# EAGLE design fcci-adapter (EAGLE 5.09)
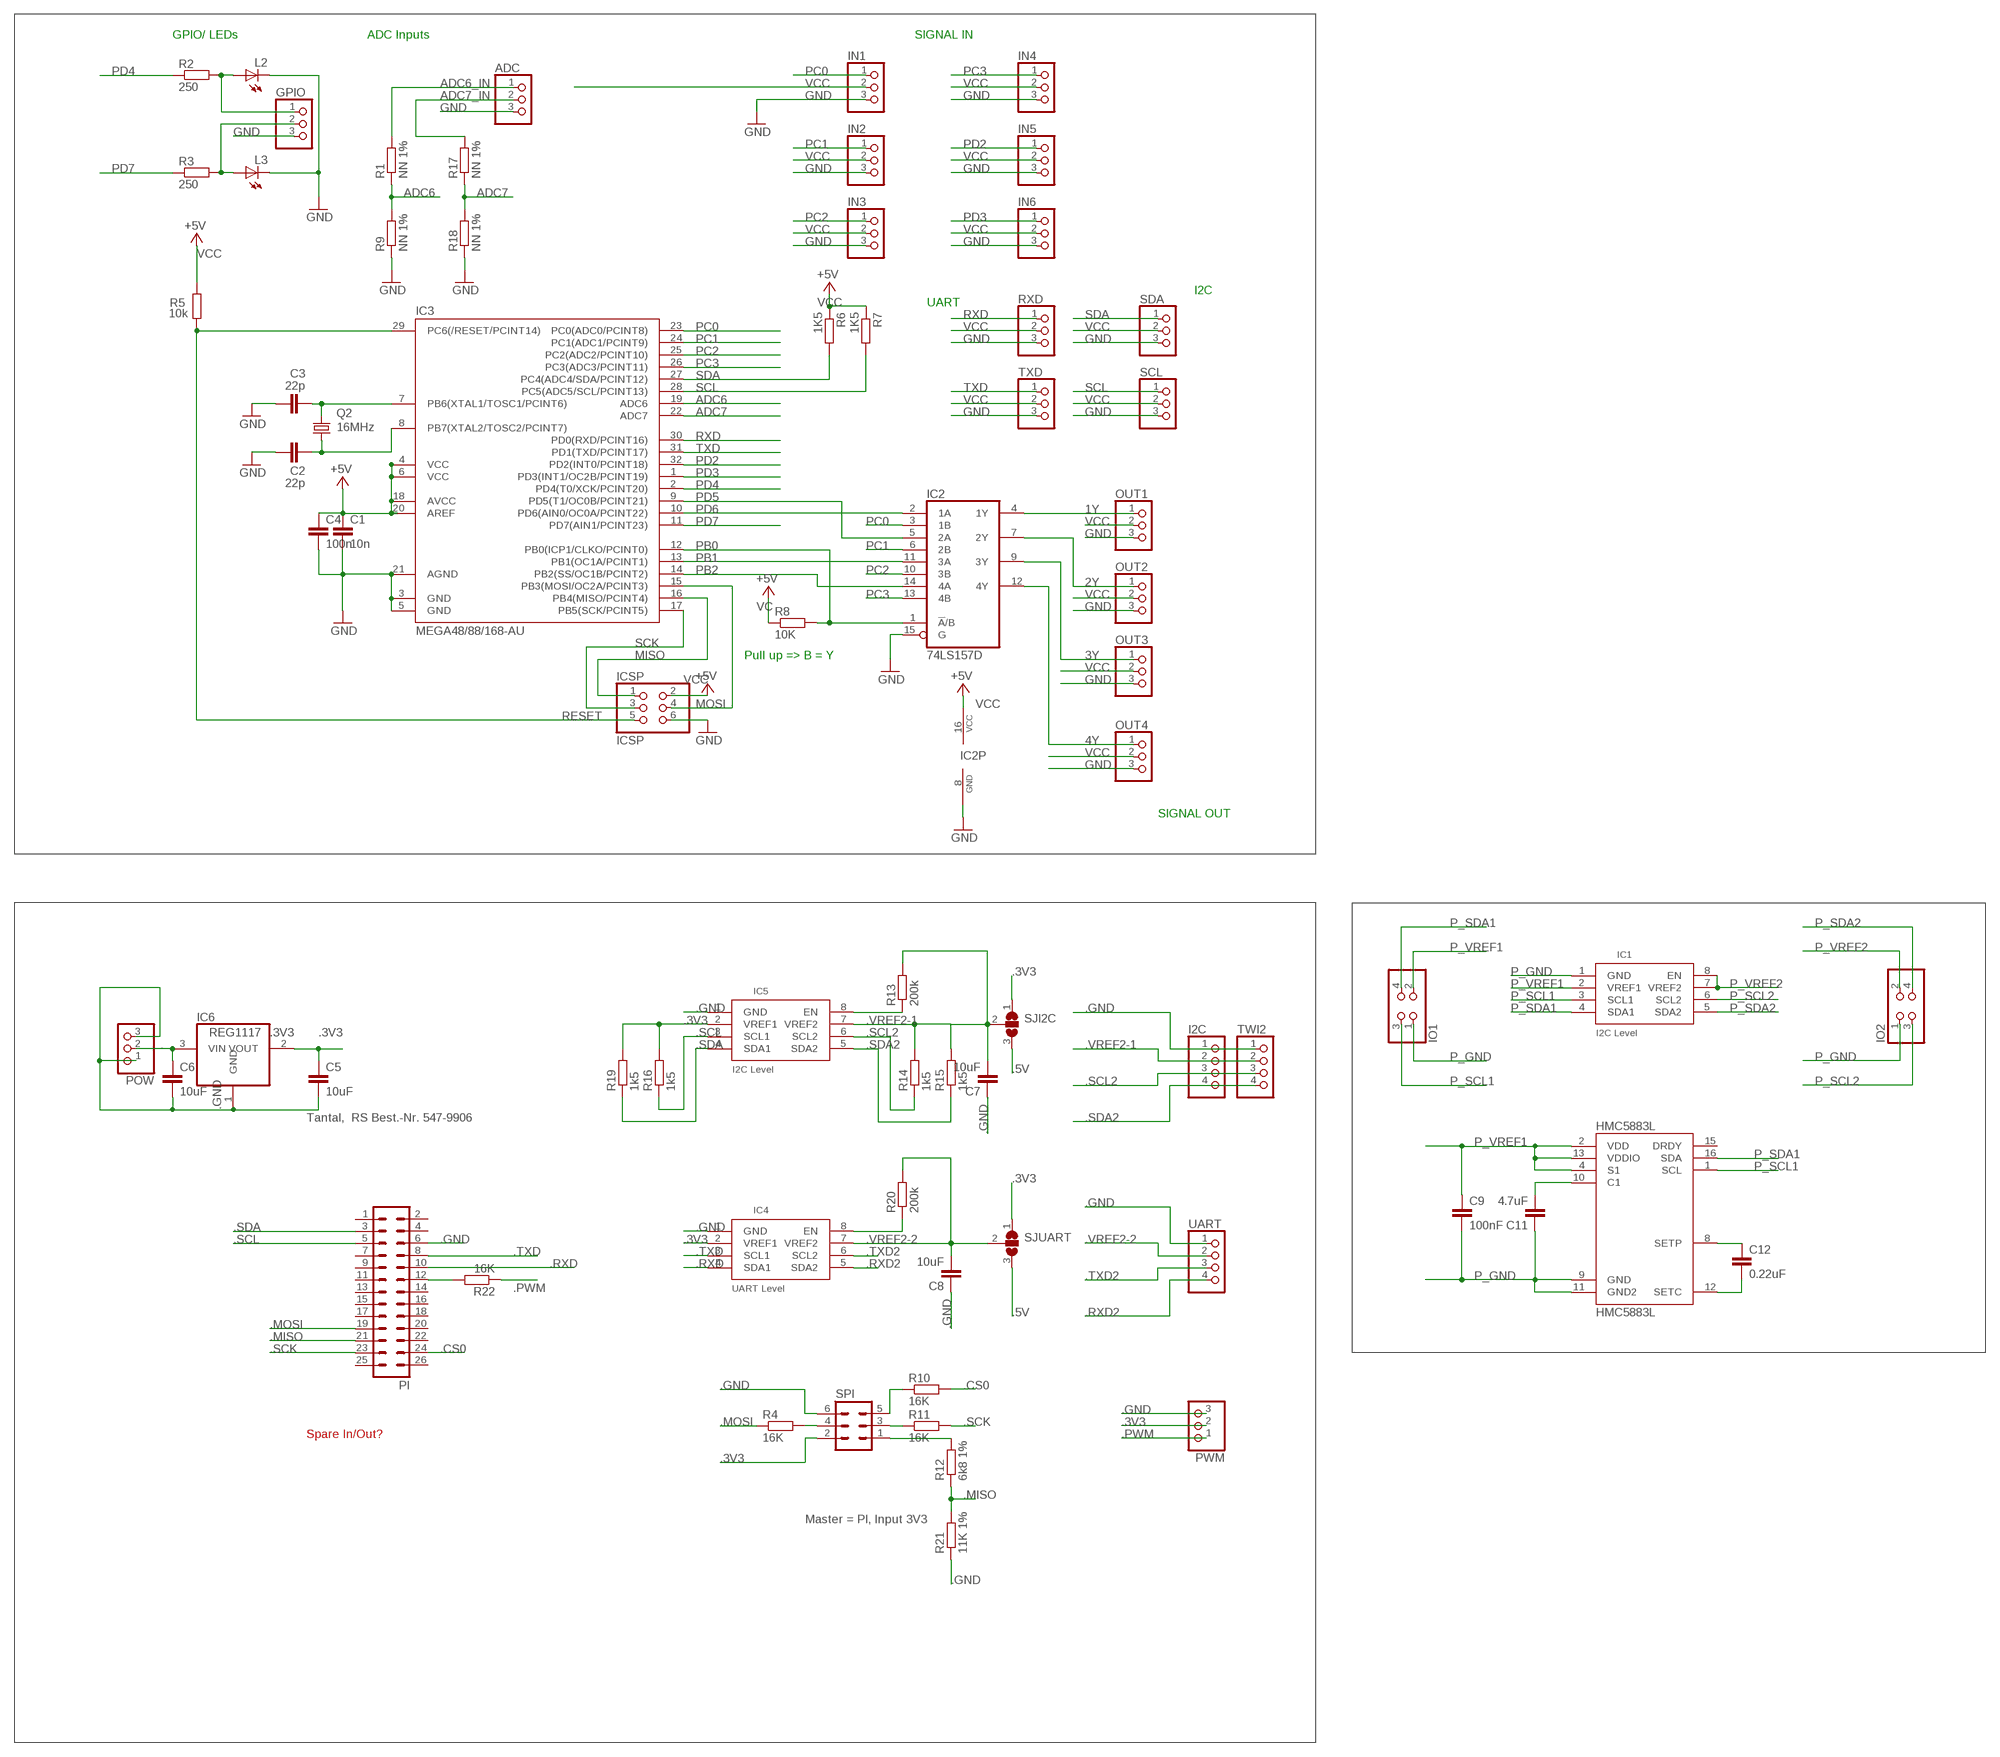
[diagram p0: schematic, sheet 1]

## Parts
ADC  PINHD-1X03_2.54-S  [1X03-S]
C1  10n  C-EUC1206K  [C1206K]
C2  22p  C-EUC1206K  [C1206K]
C3  22p  C-EUC1206K  [C1206K]
C4  100n  C-EUC1206K  [C1206K]
C5  10uF  C-EUC1608  [C1608]
C6  10uF  C-EUC1608  [C1608]
C7  10uF  C-EUC1608  [C1608]
C8  10uF  C-EUC1608  [C1608]
C9  100nF  C-EUC1206  [C1206]
C11  4.7uF  C-EUC1206  [C1206]
C12  0.22uF  C-EUC0805K  [C0805K]
GPIO  PINHD-1X03_2.54-S  [1X03-S]
HMC5883L  HMC5883L  [LPCC16]
I2C  PINHD-1X04_2.54-S  [1X04-S]
IC1  I2C Level  PCA9306  [SOIC8]
IC2  74LS157D  [SO16]
IC3  MEGA48/88/168-AU  [TQFP32-08]
IC4  UART Level  PCA9306  [SOIC8]
IC5  I2C Level  PCA9306  [SOIC8]
IC6  REG1117  [SOT223]
ICSP  ICSP  PINHD-2X3  [2X03]
IN1  PINHD-1X03_2.54-S  [1X03-S]
IN2  PINHD-1X03_2.54-S  [1X03-S]
IN3  PINHD-1X03_2.54-S  [1X03-S]
IN4  PINHD-1X03_2.54-S  [1X03-S]
IN5  PINHD-1X03_2.54-S  [1X03-S]
IN6  PINHD-1X03_2.54-S  [1X03-S]
IO1  PINHD-2X02_2.54  [2X02]
IO2  PINHD-2X02_2.54  [2X02]
L2  LEDCHIPLED_1206  [CHIPLED_1206]
L3  LEDCHIPLED_1206  [CHIPLED_1206]
OUT1  PINHD-1X03_2.54-S  [1X03-S]
OUT2  PINHD-1X03_2.54-S  [1X03-S]
OUT3  PINHD-1X03_2.54-S  [1X03-S]
OUT4  PINHD-1X03_2.54-S  [1X03-S]
PI  MA13-2  [MA13-2]
POW  PINHD-1X03_2.54-S  [1X03-S]
PWM  PINHD-1X03_2.54-S  [1X03-S]
Q2  16MHz  CRYTALHC49S  [HC49/S]
R1  NN 1%  R-EU_R0805  [R0805]
R2  250  R-EU_R1206  [R1206]
R3  250  R-EU_R1206  [R1206]
R4  16K  R-EU_R0805  [R0805]
R5  10k  R-EU_R1206  [R1206]
R6  1K5  R-EU_R1206  [R1206]
R7  1K5  R-EU_R1206  [R1206]
R8  10K  R-EU_R1206  [R1206]
R9  NN 1%  R-EU_R0805  [R0805]
R10  16K  R-EU_R0805  [R0805]
R11  16K  R-EU_R0805  [R0805]
R12  6k8 1%  R-EU_R0805  [R0805]
R13  200k  R-EU_R0805  [R0805]
R14  1k5  R-EU_R0805  [R0805]
R15  1k5  R-EU_R0805  [R0805]
R16  1k5  R-EU_R1206  [R1206]
R17  NN 1%  R-EU_R0805  [R0805]
R18  NN 1%  R-EU_R0805  [R0805]
R19  1k5  R-EU_R1206  [R1206]
R20  200k  R-EU_R0805  [R0805]
R21  11K 1%  R-EU_R0805  [R0805]
R22  16K  R-EU_R0805  [R0805]
RXD  PINHD-1X03_2.54-S  [1X03-S]
SCL  PINHD-1X03_2.54-S  [1X03-S]
SDA  PINHD-1X03_2.54-S  [1X03-S]
SJI2C  SJ2W  [SJ_2]
SJUART  SJ2W  [SJ_2]
SPI  MA03-2  [MA03-2]
TWI2  PINHD-1X04_2.54-S  [1X04-S]
TXD  PINHD-1X03_2.54-S  [1X03-S]
UART  PINHD-1X04_2.54-S  [1X04-S]

## Nets
1Y: IC2.4(1Y) OUT1.1
2Y: IC2.7(2Y) OUT2.1
3Y: IC2.9(3Y) OUT3.1
4Y: IC2.12(4Y) OUT4.1
.3V3: C5.1 IC4.2(VREF1) IC5.2(VREF1) IC6.2(VOUT) PWM.2 R16.2 R19.2 SJI2C.1 SJUART.1 SPI.2
.5V: C6.1 IC6.3(VIN) POW.2 SJI2C.3 SJUART.3
.CS0: PI.24 R10.2
.GND [gnd]: C5.2 C6.2 C7.1 C8.1 I2C.1 IC4.1(GND) IC5.1(GND) IC6.1(GND) PI.6 POW.1 POW.3 PWM.3 R21.1 SPI.6 TWI2.1 UART.1
.MISO: PI.21 R12.1 R21.2
.MOSI: PI.19 R4.1
.PWM: PWM.1 R22.1
.RXD: IC4.4(SDA1) PI.10
.RXD2: IC4.5(SDA2) UART.4
.SCK: PI.23 R11.2
.SCL: IC5.3(SCL1) PI.5 R16.1
.SCL2: I2C.3 IC5.6(SCL2) R14.1 TWI2.3
.SDA: IC5.4(SDA1) PI.3 R19.1
.SDA2: I2C.4 IC5.5(SDA2) R15.1 TWI2.4
.TXD: IC4.3(SCL1) PI.8
.TXD2: IC4.6(SCL2) UART.3
.VREF2-1: C7.2 I2C.2 IC5.7(VREF2) R13.2 R14.2 R15.2 SJI2C.2 TWI2.2
.VREF2-2: C8.2 IC4.7(VREF2) R20.2 SJUART.2 UART.2
ADC6: IC3.19(ADC6) R1.1 R9.2
ADC6_IN: ADC.1 R1.2
ADC7: IC3.22(ADC7) R17.1 R18.2
ADC7_IN: ADC.2 R17.2
GND [gnd]: ADC.3 C1.2 C2.1 C3.1 C4.2 GPIO.3 IC2.8(GND) IC2.15(G) IC3.3(GND) IC3.5(GND) IC3.21(AGND) ICSP.6 IN1.3 IN2.3 IN3.3 IN4.3 IN5.3 IN6.3 L2.C L3.C OUT1.3 OUT2.3 OUT3.3 OUT4.3 R9.1 R18.1 RXD.3 SCL.3 SDA.3 TXD.3
MISO: IC3.16(PB4(MISO/PCINT4)) ICSP.1
MOSI: IC3.15(PB3(MOSI/OC2A/PCINT3)) ICSP.4
N$1: GPIO.1 L2.A R2.2
N$2: GPIO.2 L3.A R3.2
N$3: IC5.8(EN) R13.1
N$4: R4.2 SPI.4
N$6: C2.2 IC3.8(PB7(XTAL2/TOSC2/PCINT7)) Q2.1
N$7: C3.2 IC3.7(PB6(XTAL1/TOSC1/PCINT6)) Q2.2
N$8: R10.1 SPI.5
N$9: R11.1 SPI.3
N$10: R12.2 SPI.1
N$12: IC4.8(EN) R20.1
N$18: C12.2 HMC5883L.12(SETC)
N$19: C12.1 HMC5883L.8(SETP)
N$20: C11.2 HMC5883L.10(C1)
P_GND: C9.2 C11.1 HMC5883L.9(GND) HMC5883L.11(GND2) IC1.1(GND) IO1.1 IO2.1
P_SCL1: HMC5883L.1(SCL) IC1.3(SCL1) IO1.3
P_SCL2: IC1.6(SCL2) IO2.3
P_SDA1: HMC5883L.16(SDA) IC1.4(SDA1) IO1.4
P_SDA2: IC1.5(SDA2) IO2.4
P_VREF1: C9.1 HMC5883L.2(VDD) HMC5883L.4(S1) HMC5883L.13(VDDIO) IC1.2(VREF1) IO1.2
P_VREF2: IC1.7(VREF2) IC1.8(EN) IO2.2
PB0: IC2.1(!A!/B) IC3.12(PB0(ICP1/CLKO/PCINT0)) R8.2
PB1: IC2.11(3A) IC3.13(PB1(OC1A/PCINT1))
PB2: IC2.14(4A) IC3.14(PB2(SS/OC1B/PCINT2))
PC0: IC2.3(1B) IC3.23(PC0(ADC0/PCINT8)) IN1.1
PC1: IC2.6(2B) IC3.24(PC1(ADC1/PCINT9)) IN2.1
PC2: IC2.10(3B) IC3.25(PC2(ADC2/PCINT10)) IN3.1
PC3: IC2.13(4B) IC3.26(PC3(ADC3/PCINT11)) IN4.1
PD2: IC3.32(PD2(INT0/PCINT18)) IN5.1
PD3: IC3.1(PD3(INT1/OC2B/PCINT19)) IN6.1
PD4: IC3.2(PD4(T0/XCK/PCINT20)) R2.1
PD5: IC2.5(2A) IC3.9(PD5(T1/OC0B/PCINT21))
PD6: IC2.2(1A) IC3.10(PD6(AIN0/OC0A/PCINT22))
PD7: IC3.11(PD7(AIN1/PCINT23)) R3.1
PWM_: PI.12 R22.2
RESET: IC3.29(PC6(/RESET/PCINT14)) ICSP.5 R5.1
RXD: IC3.30(PD0(RXD/PCINT16)) RXD.1
SCK: IC3.17(PB5(SCK/PCINT5)) ICSP.3
SCL: IC3.28(PC5(ADC5/SCL/PCINT13)) R7.2 SCL.1
SDA: IC3.27(PC4(ADC4/SDA/PCINT12)) R6.2 SDA.1
TXD: IC3.31(PD1(TXD/PCINT17)) TXD.1
VC: R8.1 ; supply symbol labelled +5V
VCC: C1.1 C4.1 IC2.16(VCC) IC3.4(VCC) IC3.6(VCC) IC3.18(AVCC) IC3.20(AREF) ICSP.2 IN1.2 IN2.2 IN3.2 IN4.2 IN5.2 IN6.2 OUT1.2 OUT2.2 OUT3.2 OUT4.2 R5.2 R6.1 R7.1 RXD.2 SCL.2 SDA.2 TXD.2 ; supply symbol labelled +5V
Unconnected: HMC5883L.15(DRDY) PI.1 PI.2 PI.4 PI.7 PI.9 PI.11 PI.13 PI.14 PI.15 PI.16 PI.17 PI.18 PI.20 PI.22 PI.25 PI.26

## Notes on the sheet
- GPIO/ LEDs | ADC Inputs | SIGNAL IN
- I2C
- UART
- Pull up => B = Y
- SIGNAL OUT
- Tantal,  RS Best.-Nr. 547-9906
- Spare In/Out?
- Master = PI, Input 3V3

## Library data of the parts
ADC GPIO IN1-IN6 OUT1-OUT4 POW PWM RXD SCL SDA TXD = pinhead-2:PINHD-1X03: PIN HEADER
C1-C9 C11 C12 = rcl:C-EU: CAPACITOR, European symbol
HMC5883L = 3DRobotics_Master_Library:HMC5883L: Honeywell HMC5883L 3-axis digital compass IC Successor to the HMC5843.; DATASHEET: http://www.dsscircuits.com/images/datasheets/HMC5883L.pdf; LINK: http://parts.digikey.com/1/parts/2057013-ic-compass-3-axis-i2c-16lcc-smd-hmc5883l-tr.html; MFGPN: HMC5883L-TR
I2C TWI2 UART = pinhead-2:PINHD-1X04: PIN HEADER
IC1 IC4 IC5 = 3DRobotics_Master_Library:PCA9306: I2C Level translator. Digi-Key part: 568-4215-1-ND By Jordi Munoz; DATASHEET: http://www.nxp.com/documents/data_sheet/PCA9306.pdf; LINK: http://search.digikey.com/scripts/DkSearch/dksus.dll?Detail&name=568-4215-1-ND; MFGPN: PCA9306D,118; PN: 568-4215-1-ND
IC2 = 74xx-us:74*157: Quadruple 2-line to 1-line data SELECTOR/MULTIPLEXER
IC3 = avr-7:MEGA48/88/168
IC6 = burr-brown:REG1117: 800mA and 1A Low Dropout (LDO) Positive Regulator 1.8V, 2.5V, 2.85V, 3.3V, 5V, and Adj
ICSP = pinhead:PINHD-2X3: PIN HEADER
IO1 IO2 = pinhead-2:PINHD-2X02: PIN HEADER
L2 L3 = led:LED: LED OSRAM: - CHIPLED LG R971, LG N971, LY N971, LG Q971, LY Q971, LO R971, LY R971 LH N974, LH R974 LS Q976, LO Q976, LY Q976 LO Q996 - Hyper CHIPLED LW Q18S LB Q993, LB Q99A, LB R99A - SideLED LS A670, LO A670, LY A670, LG A670, LP A670 LB A673, LV A673, LT A673, LW A673 LH A674 LY A675 LS A676, LA A676, LO A676, LY A676, LW A676 LS A679, LY A679, LG A679 - Hyper Micro SIDELED® LS Y876, LA Y876, LO Y876, LY Y876 LT Y87S - SmartLED LW L88C, LW L88S LB L89C, LB L89S, LG L890 LS L89K, LO L89K, LY L89K LS L896, LA L896, LO L896, LY L896 - TOPLED LS T670, LO T670, LY T670, LG T670, LP T670 LSG T670, LSP T670, LSY T670, LOP T670, LYG T670 LG T671, LOG T671, LSG T671 LB T673, LV T673, LT T673, LW T673 LH T674 LS T676, LA T676, LO T676, LY T676, LB T676, LH T676, LSB T676, LW T676 LB T67C, LV T67C, LT T67C, LS T67K, LO T67K, LY T67K, LW E67C LS E67B, LA E67B, LO E67B, LY E67B, LB E67C, LV E67C, LT E67C LW T67C LS T679, LY T679, LG T679 LS T770, LO T770, LY T770, LG T770, LP T770 LB T773, LV T773, LT T773, LW T773 LH T774 LS E675, LA E675, LY E675, LS T675 LS T776, LA T776, LO T776, LY T776, LB T776 LHGB T686 LT T68C, LB T68C - Hyper Mini TOPLED® LB M676 - Mini TOPLED Santana® LG M470 LS M47K, LO M47K, LY M47K Source: http://www.osram.convergy.de LUXEON: - LUMILED® LXK2-PW12-R00, LXK2-PW12-S00, LXK2-PW14-U00, LXK2-PW14-V00 LXK2-PM12-R00, LXK2-PM12-S00, LXK2-PM14-U00 LXK2-PE12-Q00, LXK2-PE12-R00, LXK2-PE12-S00, LXK2-PE14-T00, LXK2-PE14-U00 LXK2-PB12-K00, LXK2-PB12-L00, LXK2-PB12-M00, LXK2-PB14-N00, LXK2-PB14-P00, LXK2-PB14-Q00 LXK2-PR12-L00, LXK2-PR12-M00, LXK2-PR14-Q00, LXK2-PR14-R00 LXK2-PD12-Q00, LXK2-PD12-R00, LXK2-PD12-S00 LXK2-PH12-R00, LXK2-PH12-S00 LXK2-PL12-P00, LXK2-PL12-Q00, LXK2-PL12-R00 Source: www.luxeon.com KINGBRIGHT: KA-3528ASYC Source: www.kingbright.com
PI = con-lstb:MA13-2: PIN HEADER
Q2 = crystal:CRYTAL: CRYSTAL
R1-R22 = rcl:R-EU_: RESISTOR, European symbol
SJI2C SJUART = jumper:SJ2W: SMD solder JUMPER
SPI = con-lstb:MA03-2: PIN HEADER

## Net classes
0 default: width 0.254 mm, drill 0.305 mm, clearance 0.152 mm
1 power: width 0.61 mm, drill 0.508 mm, clearance 0.152 mm
2 gnd: width 0.305 mm, drill 0.508 mm, clearance 0.152 mm
3 usbvcc: width 0.508 mm, drill 0.508 mm, clearance 0.152 mm
4 aref: width 0.406 mm

## Board
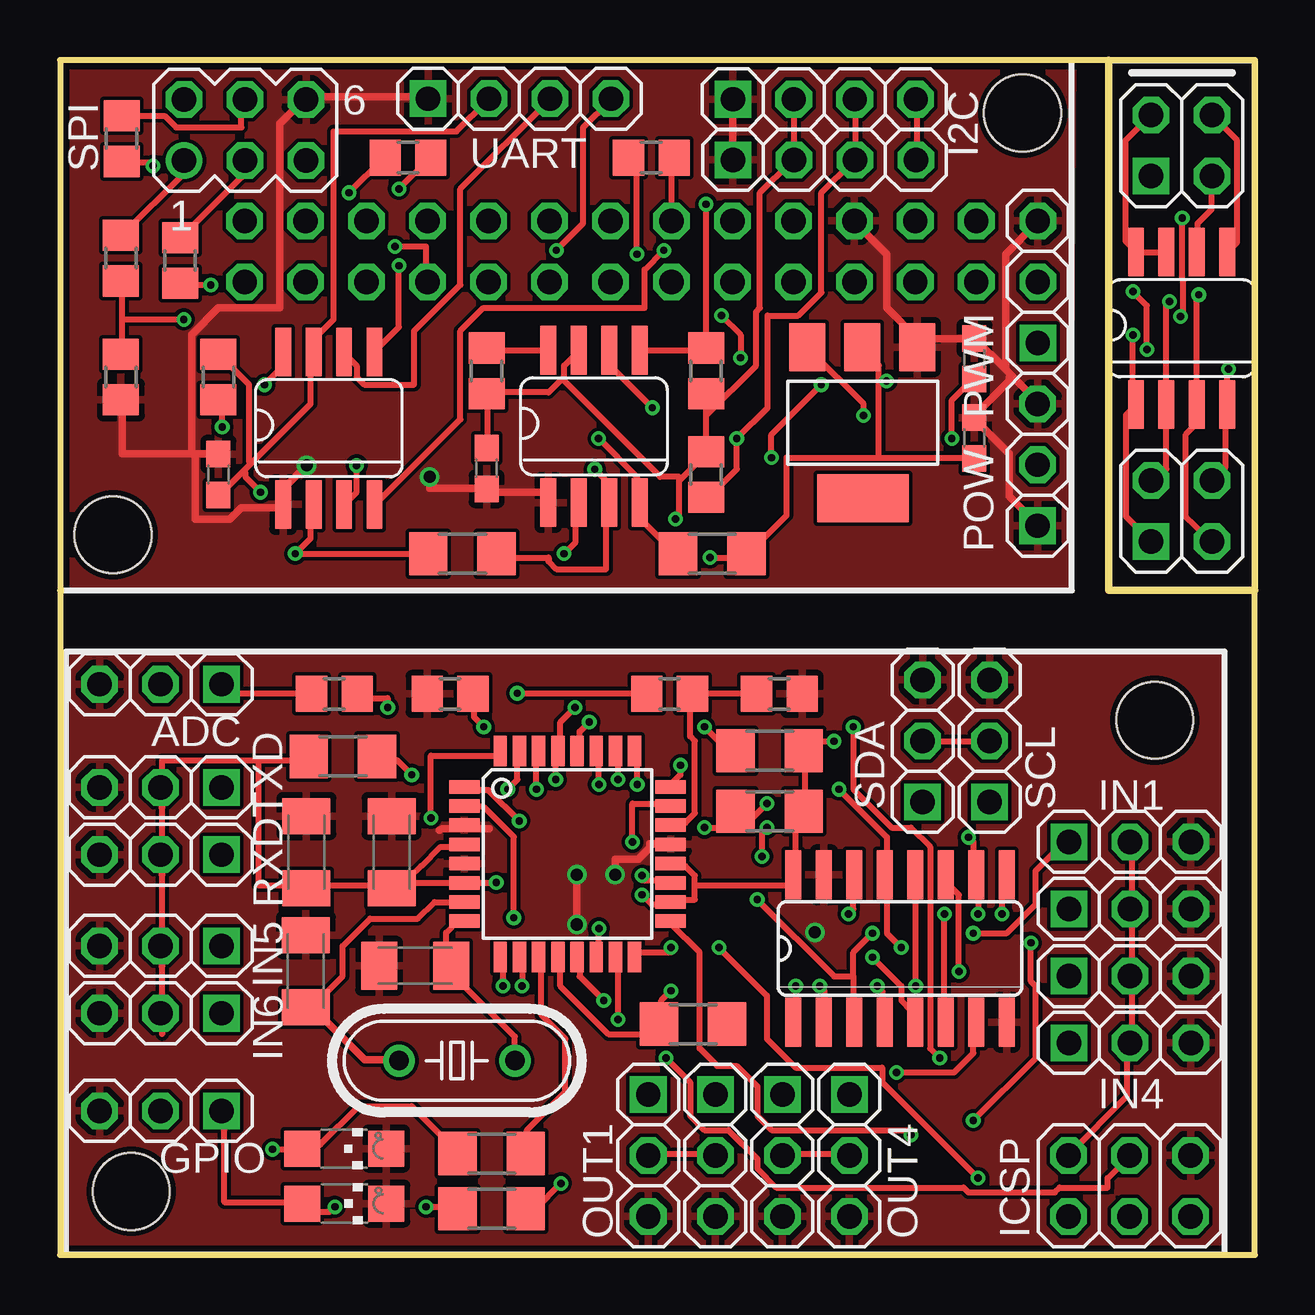
[diagram p1: board, top side]
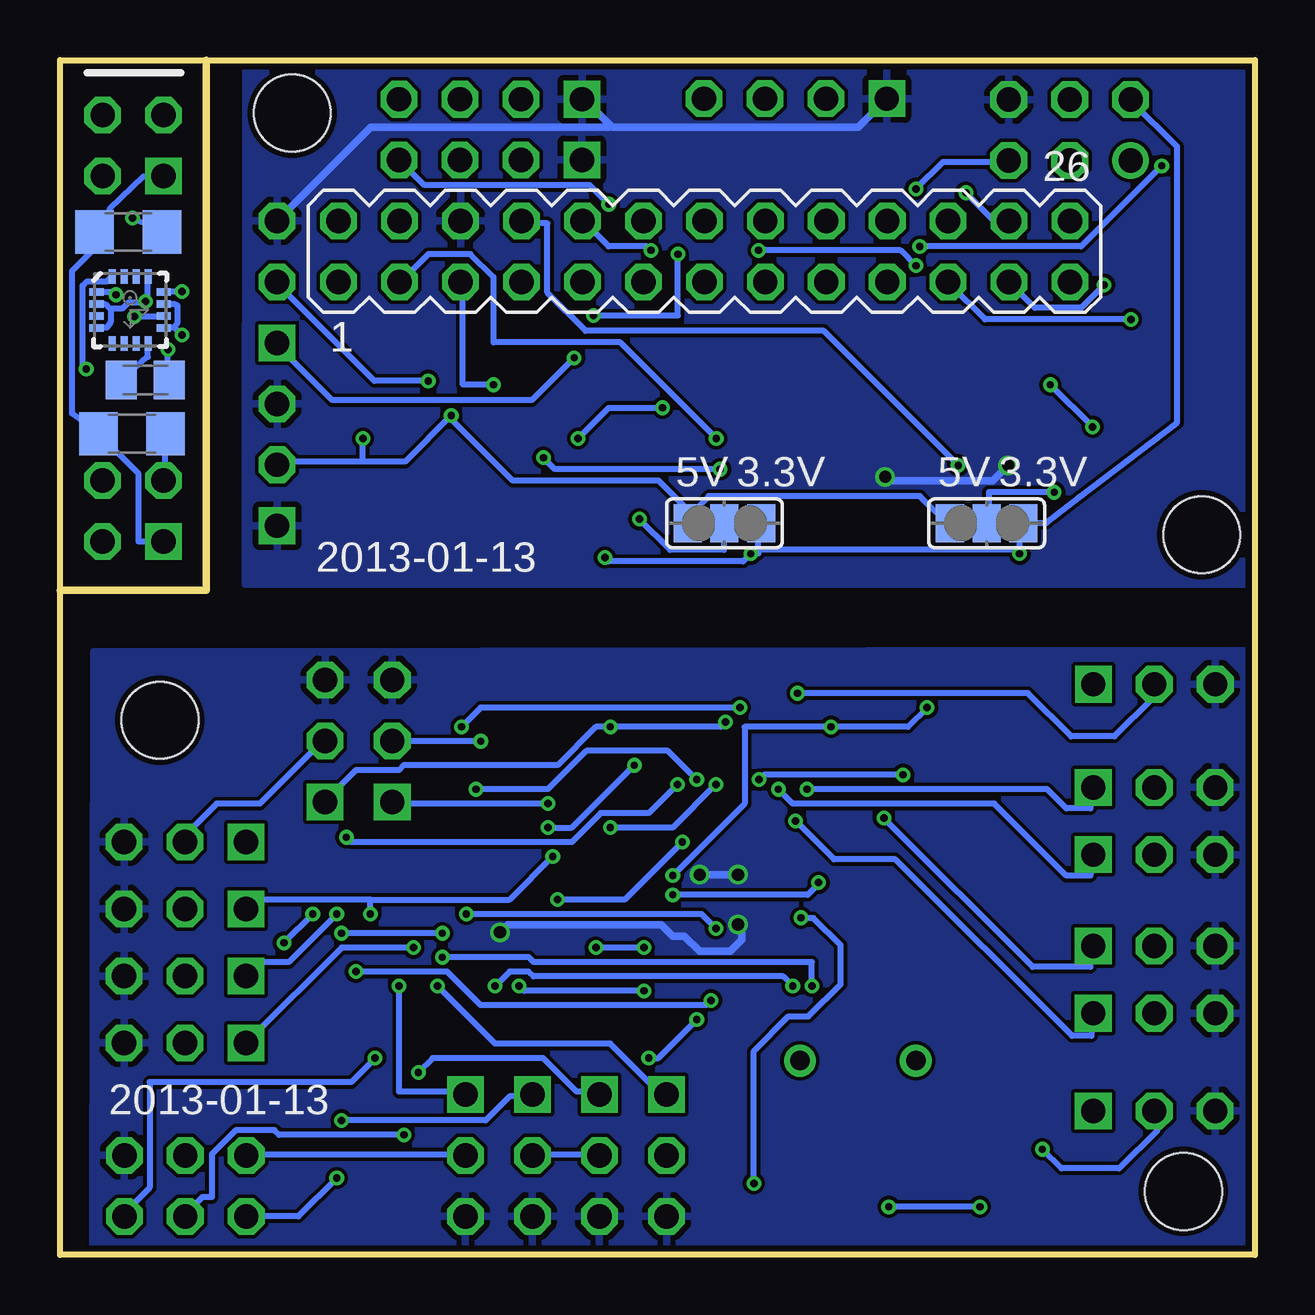
[diagram p2: board, bottom side, seen from below]

Size 49.78 x 49.78 mm. Coordinates in mm from the lower left corner, seen from the top.
Outline: 49.78,27.69 49.78,0 0,0 0,49.78 43.69,49.78
Outline: 49.78,27.69 49.78,49.78 43.69,49.78
Outline: 49.78,27.69 43.69,27.69 43.69,49.78
Copper layers (1*16): Top 0.035mm / dielectric 1.5mm / Bottom 0.035mm
Design rules "ITEADstudio_DRC": minimum track width 6mil, minimum drill 12mil, track to track 6mil, track to pad 6mil, pad to pad 6mil, via to via 6mil, smd to smd 0mil, copper to edge 10mil, drill to drill 10mil, minimum pad ring 10mil, minimum via ring 6mil, stop-mask expansion 2mil, vias tented up to drill 100mil, thermal gap 10mil
Holes 3.2 mm at 40.11,47.57 45.62,22.28 2.21,30 2.97,2.64

### Footprints (pad centres in the part's own frame; a part is rotated, then mirrored left to right if it is on the bottom)
1X03-S = drill 1.016 square: 1 -2.54,0 | drill 1.016 octagon: 2 0,0; 3 2.54,0
C1206K = smd 1.5 x 2: 1 -1.5,0; 2 1.5,0
C1608 = smd 1.1 x 1: 1 -0.85,0; 2 0.85,0
C1206 = smd 1.6 x 1.8: 1 -1.4,0; 2 1.4,0
C0805K = smd 1.3 x 1.6: 1 -1,0; 2 1,0
LPCC16 = smd 0.6 x 0.3: 1 -1.4,0.75; 2 -1.4,0.25; 3 -1.4,-0.25; 4 -1.4,-0.75; 9 1.4,-0.75; 10 1.4,-0.25; 11 1.4,0.25; 12 1.4,0.75 | smd 0.3 x 0.6: 5 -0.75,-1.4; 6 -0.25,-1.4; 7 0.25,-1.4; 8 0.75,-1.4; 13 0.75,1.4; 14 0.25,1.4; 15 -0.25,1.4; 16 -0.75,1.4
1X04-S = drill 1.016 square: 1 -3.81,0 | drill 1.016 octagon: 2 -1.27,0; 3 1.27,0; 4 3.81,0
SOIC8 = smd 0.66 x 2.032: 1 -1.905,-3.175; 2 -0.635,-3.175; 3 0.635,-3.175; 4 1.905,-3.175; 5 1.905,3.175; 6 0.635,3.175; 7 -0.635,3.175; 8 -1.905,3.175
SO16 = smd 0.66 x 2.032: 1 -4.445,-3.073; 2 -3.175,-3.073; 3 -1.905,-3.073; 4 -0.635,-3.073; 5 0.635,-3.073; 6 1.905,-3.073; 7 3.175,-3.073; 8 4.445,-3.073; 9 4.445,3.073; 10 3.175,3.073; 11 1.905,3.073; 12 0.635,3.073; 13 -0.635,3.073; 14 -1.905,3.073; 15 -3.175,3.073; 16 -4.445,3.073
TQFP32-08 = smd 1.27 x 0.559: 1 -4.293,2.8; 2 -4.293,2; 3 -4.293,1.2; 4 -4.293,0.4; 5 -4.293,-0.4; 6 -4.293,-1.2; 7 -4.293,-2; 8 -4.293,-2.8; 17 4.293,-2.8; 18 4.293,-2; 19 4.293,-1.2; 20 4.293,-0.4; 21 4.293,0.4; 22 4.293,1.2; 23 4.293,2; 24 4.293,2.8 | smd 0.559 x 1.27: 9 -2.8,-4.293; 10 -2,-4.293; 11 -1.2,-4.293; 12 -0.4,-4.293; 13 0.4,-4.293; 14 1.2,-4.293; 15 2,-4.293; 16 2.8,-4.293; 25 2.8,4.293; 26 2,4.293; 27 1.2,4.293; 28 0.4,4.293; 29 -0.4,4.293; 30 -1.2,4.293; 31 -2,4.293; 32 -2.8,4.293
SOT223 = smd 1.499 x 2.007: 1 -2.261,-3.15; 2 0.025,-3.15; 3 2.311,-3.15 | smd 3.81 x 2.007: 4 0,3.15
2X03 = drill 1.016 octagon: 1 -2.54,-1.27; 2 -2.54,1.27; 3 0,-1.27; 4 0,1.27; 5 2.54,-1.27; 6 2.54,1.27
2X02 = drill 1.016 square: 1 -1.27,-1.27 | drill 1.016 octagon: 2 -1.27,1.27; 3 1.27,-1.27; 4 1.27,1.27
CHIPLED_1206 = smd 1.5 x 1.5: A 0,-1.75; C 0,1.75
MA13-2 = drill 1.016 octagon: 1 -15.24,-1.27; 2 -15.24,1.27; 3 -12.7,-1.27; 4 -12.7,1.27; 5 -10.16,-1.27; 6 -10.16,1.27; 7 -7.62,-1.27; 8 -7.62,1.27; 9 -5.08,-1.27; 10 -5.08,1.27; 11 -2.54,-1.27; 12 -2.54,1.27; 13 0,-1.27; 14 0,1.27; 15 2.54,-1.27; 16 2.54,1.27; 17 5.08,-1.27; 18 5.08,1.27; 19 7.62,-1.27; 20 7.62,1.27; 21 10.16,-1.27; 22 10.16,1.27; 23 12.7,-1.27; 24 12.7,1.27; 25 15.24,-1.27; 26 15.24,1.27
HC49/S = drill 0.813 round: 1 -2.413,0; 2 2.413,0
R0805 = smd 1.3 x 1.5: 1 -0.95,0; 2 0.95,0
R1206 = smd 1.6 x 1.803: 1 -1.422,0; 2 1.422,0
SJ_2 = smd 1.168 x 1.6: 1 -1.524,0; 2 0,0; 3 1.524,0
MA03-2 = drill 1.016 round: 1 -2.54,-1.27 | drill 1.016 octagon: 2 -2.54,1.27; 3 0,-1.27; 4 0,1.27; 5 2.54,-1.27; 6 2.54,1.27

### Placement (x,y rotation side)
ADC  4.19,23.77 180 top
C1  13.82,16.78 90 top
C2  14.8,12.04 0 top
C3  10.25,11.82 270 top
C4  10.26,16.78 90 top
C5  38.1,34.04 90 top
C6  38.1,37.34 90 top
C7  17.78,32.77 90 top
C8  6.6,32.51 270 top
C9  46.79,34.21 180 bottom
C11  46.94,42.62 0 bottom
C12  46.23,36.45 0 bottom
GPIO  4.19,5.99 180 top
HMC5883L  46.86,39.37 0 bottom
I2C  31.84,48.15 0 top
IC1  46.74,38.61 0 top
IC2  35,12.76 0 top
IC3  21.15,16.7 0 top
IC4  11.2,34.44 0 top
IC5  22.25,34.52 0 top
IC6  33.45,34.67 180 top
ICSP  44.56,2.87 0 top
IN1  44.58,17.2 0 top
IN2  44.58,14.41 0 top
IN3  44.58,11.62 0 top
IN4  44.58,8.83 0 top
IN5  4.19,12.87 180 top
IN6  4.19,10.07 180 top
IO1  46.74,30.99 0 top
IO2  46.73,46.21 0 top
L2  11.85,2.13 270 top
L3  11.84,4.42 270 top
OUT1  24.51,4.14 270 top
OUT2  27.3,4.14 270 top
OUT3  30.1,4.14 270 top
OUT4  32.89,4.14 270 top
PI  22.94,41.81 0 bottom
POW  40.74,32.92 90 top
PWM  40.74,40.54 90 top
Q2  16.54,8.09 180 top
R1  11.43,23.37 180 top
R2  17.98,1.92 180 top
R3  17.98,4.22 180 top
R4  2.57,46.51 90 top
R5  11.79,20.76 180 top
R6  29.57,18.48 180 top
R7  29.57,21.01 180 top
R8  26.38,9.61 180 top
R9  16.26,23.37 0 top
R10  14.5,45.72 180 top
R11  5,41.43 270 top
R12  2.54,41.53 90 top
R13  17.78,36.83 270 top
R14  26.92,32.51 90 top
R15  26.92,36.83 270 top
R16  16.76,29.21 180 top
R17  25.4,23.37 180 top
R18  29.97,23.37 180 top
R19  27.18,29.21 0 top
R20  6.6,36.58 90 top
R21  2.54,36.58 90 top
R22  24.64,45.72 0 top
RXD  4.19,16.67 180 top
SCL  38.73,21.41 90 top
SDA  35.94,21.41 90 top
SJI2C  22.1,30.48 180 bottom
SJUART  11.18,30.48 180 bottom
SPI  7.71,46.87 0 top
TWI2  31.85,45.62 0 top
TXD  4.19,19.47 180 top
UART  19.14,48.17 0 top

### Tracks (layer width: path | path; a pad name or v marks a point on that pad's centre or on a via)
1Y  (via drill 0.3)
  Top 0.254: v34.05,11.2 34.25,11 34.25,9.8 IC2.4
  Bottom 0.254: v34.05,11.2 31.65,8.8 26.85,8.8 24.85,6.8 24.65,6.8 OUT1.1
2Y  (via drill 0.3)
  Top 0.254: v34.85,7.6 37.25,7.6 38.05,8.4 38.05,9.6 IC2.7
  Bottom 0.254: v34.85,7.6 34.25,8.2 29.65,8.2 28.25,6.8 27.45,6.8 OUT2.1
3Y  (via drill 0.3)
  Top 0.254: v39.25,14.2 39.25,15.8 IC2.9 | v40.45,13 40.45,11.4 40.65,11.2 40.65,8.2 v38.05,5.6
  Bottom 0.254: v40.45,13 v39.25,14.2 | v38.05,5.6 32.05,5.6 31.05,6.6 30.25,6.6 OUT3.1
4Y  (via drill 0.3)
  Top 0.254: v35.65,11.2 35.65,15.8 IC2.12
  Bottom 0.254: v35.65,11.2 35.65,6.8 33.05,6.8 OUT4.1
.3V3  (via drill 0.3)
  Top 0.254: v21,29.21 21.48,29.69 21.48,31.29 IC5.2 | IC4.2 10.44,31.13 10.44,29.85 v9.8,29.21 15.24,29.21 R16.2 | v27.08,29.05 28.52,29.05 R19.2 28.68,29.21 30.28,30.81 30.28,33.21 34.12,33.21 | 34.12,33.21 37.96,33.21 C5.1 | 34.12,36.41 34.12,37.05 33.48,37.69 IC6.2 | 34.12,33.21 34.12,36.41 | 34.12,36.41 v34.44,36.41
  Bottom 0.254: 20.68,29.37 20.68,29.21 v21,29.21 21.32,28.89 26.92,28.89 v27.08,29.05 | 20.68,29.37 20.68,30.33 SJI2C.1 | 9.8,29.37 9.8,30.33 SJUART.1 9.64,30.49 8.68,30.49 7.32,31.57 3.24,34.67 3.24,46.17 5.16,48.09 SPI.2 | 9.8,29.37 20.68,29.37 | v9.8,29.21 9.8,29.37 | v34.44,36.41 36.68,36.41 40.68,40.41 PWM.2
.5V  (via drill 0.3)
  Top 0.254: v33.48,34.97 33.48,35.45 31.24,37.69 IC6.3 | v37.16,34.01 37.16,35.61 37.96,36.41 C6.1
  Bottom 0.254: SJUART.3 12.84,30.49 13.96,31.61 22.76,31.61 23.56,30.81 23.56,30.49 SJI2C.3 23.56,30.97 24.84,32.25 30.92,32.25 33.48,34.81 v33.48,34.97 35.4,33.05 37.16,33.05 | 37.16,33.05 40.68,33.05 POW.2 | 37.16,33.05 v37.16,34.01
.CS0  (via drill 0.3)
  Top 0.254: v12.04,44.25 13.48,45.69 R10.2
  Bottom 0.254: v12.04,44.25 10.92,43.13 10.28,43.13 PI.24
.GND  (via drill 0.51)
  Top 0.305: IC5.1 20.2,31.45 20.2,31.77 17.8,31.77 C7.1 17.64,31.93 15.4,31.93 v15.4,32.41 | 5.48,33.37 2.6,33.37 2.6,35.61 R21.1 | 5.64,33.37 5.48,33.37 | 5.64,33.37 6.6,33.37 C8.1 | 5.64,33.37 5.64,30.65 7.08,30.65 7.56,31.13 9.16,31.13 IC4.1 9.32,31.29 9.32,31.93 v10.28,32.89 | 35.72,38.17 37.96,38.17 C6.2 38.12,38.17 39.32,36.97 | 35.72,38.17 35.72,37.85 IC6.1 35.72,38.17 | 39.32,36.97 39.64,36.65 | 39.64,36.65 40.68,35.61 POW.3 | 35.72,38.17 34.44,39.45 34.44,41.69 33.16,42.97 PI.6 | PWM.3 40.68,42.97 39.4,41.69 39.4,37.05 39.32,36.97 | I2C.1 28.04,48.09 28.04,45.69 TWI2.1 | UART.1 15.24,48.25 10.28,48.25 SPI.6 10.12,48.09 9.16,47.13 9.16,39.45 6.6,39.45 5.48,38.33 5.48,33.37 | 39.64,36.65 39.56,36.57 39.56,36.41 38.12,34.97 C5.2 38.12,34.81 39.56,33.37 39.56,31.61 40.68,30.49 POW.1
  Bottom 0.305: v15.4,32.41 15.24,32.25 10.92,32.25 v10.28,32.89 | 26.84,47.05 26.76,46.97 16.52,46.97 15.4,48.09 UART.1 | 26.84,47.05 27.88,48.09 I2C.1 | PWM.3 40.68,43.13 36.84,46.97 26.92,46.97 26.84,47.05
  pour Top: 0.13,49.81 0,27.94 42.06,27.79 42.19,50.06
  pour Bottom: -0.43,49.58 -0.25,27.94 42.06,27.94 42.04,49.76
.MISO  (via drill 0.3)
  Top 0.254: 2.6,38.97 2.6,40.57 R12.1 | 2.6,38.97 2.6,37.53 R21.2 | 2.6,38.97 v5.16,38.97
  Bottom 0.254: v5.16,38.97 11.24,38.97 12.68,40.41 PI.21
.MOSI  (via drill 0.3)
  Top 0.254: v3.88,45.37 3.88,45.53 2.6,45.53 R4.1 | v13.96,42.01 15.24,42.01 15.24,40.57 PI.19
  Bottom 0.254: v3.88,45.37 7.24,42.01 v13.96,42.01
.PWM  (via drill 0.3)
  Top 0.254: v24.04,41.69 24.04,45.37 23.72,45.69 R22.1 | v27.56,39.13 28.36,38.33 v28.36,37.37
  Bottom 0.254: v24.04,41.69 24.04,39.13 v27.56,39.13 | v28.36,37.37 30.12,35.61 38.44,35.61 40.68,37.85 PWM.1
.RXD  (via drill 0.3)
  Top 0.254: v25.16,41.85 24.36,41.05 24.36,39.45 17.64,39.45 16.68,38.49 16.68,34.81 13.16,31.29 IC4.4
  Bottom 0.254: v25.16,41.85 25.32,42.01 26.92,42.01 27.88,42.97 PI.10
.RXD2  (via drill 0.3)
  Top 0.254: v14.12,41.21 14.12,38.65 13.16,37.69 IC4.5 | v20.68,41.85 21.8,42.97 21.8,46.97 22.92,48.09 UART.4
  Bottom 0.254: v14.12,41.21 14.76,41.85 v20.68,41.85
.SCK  (via drill 0.3)
  Top 0.254: v6.28,40.41 5.16,40.41 R11.2
  Bottom 0.254: v6.28,40.41 7.24,39.45 9.16,39.45 10.12,40.41 PI.23
.SCL  (via drill 0.3)
  Top 0.254: R16.1 18.28,29.05 20.36,29.05 20.36,28.89 20.68,28.57 22.76,28.57 22.76,31.29 IC5.3 22.76,31.45 22.76,32.25 v22.28,32.73 | v31.72,36.25 29.64,34.17 v29.64,33.21
  Bottom 0.254: v31.72,36.25 33,36.25 33,40.41 PI.5 | v29.64,33.21 29.16,32.73 v22.28,32.73
.SCL2  (via drill 0.3)
  Top 0.254: I2C.3 33.16,48.09 33.16,45.69 TWI2.3 33,45.53 31.72,44.25 31.72,40.09 30.76,39.13 29.48,39.13 29.48,35.29 v28.2,34.01 28.2,32.73 27.08,31.61 R14.1 | v24.68,35.29 22.92,37.05 22.92,37.53 IC5.6
  Bottom 0.254: v28.2,34.01 26.92,35.29 v24.68,35.29
.SDA  (via drill 0.3)
  Top 0.254: R19.1 25.64,29.21 24.2,30.65 24.2,31.29 IC5.4 24.04,31.45 24.04,32.41 v22.44,34.01
  Bottom 0.254: v22.44,34.01 26.44,38.01 31.72,38.01 31.72,40.73 32.68,41.69 34.44,41.69 35.56,40.57 PI.3
.SDA2  (via drill 0.3)
  Top 0.254: IC5.5 24.2,37.69 26.92,37.69 R15.1 26.92,37.85 v26.92,43.77 | I2C.4 35.72,48.09 35.72,45.69 TWI2.4
  Bottom 0.254: v26.92,43.77 27.72,44.57 34.6,44.57 35.56,45.53 TWI2.4
.TXD  (via drill 0.3)
  Top 0.254: v12.36,32.89 12.36,31.77 11.88,31.29 IC4.3
  Bottom 0.254: v12.36,32.89 17.96,38.49 27.88,38.49 29.48,40.09 29.48,42.97 30.44,42.97 PI.8
.TXD2
  Top 0.254: IC4.6 11.88,37.53 12.36,37.05 12.36,36.57 12.68,36.25 14.76,36.25 14.76,38.49 16.68,40.41 16.68,44.41 20.36,48.09 UART.3
.VREF2-1  (via drill 0.3)
  Top 0.254: C7.2 17.8,33.69 17.8,35.77 R13.2 17.8,35.93 20.36,35.93 20.92,36.49 | 20.92,36.49 21,36.57 21,37.05 21.48,37.53 IC5.7 | I2C.2 30.6,48.09 30.6,45.69 TWI2.2 30.44,45.53 29.16,44.25 29.16,39.45 29,39.29 29,37.05 26.92,34.97 | 26.92,34.97 26.92,35.77 R15.2 | 26.92,34.97 26.92,33.53 R14.2 26.92,33.37 25.88,32.33 | v25.64,30.65 25.8,30.81 25.8,32.25 25.88,32.33 | 20.92,36.49 25,32.41 25.8,32.41 25.88,32.33
  Bottom 0.254: v25.64,30.65 24.36,29.37 22.12,29.37 22.12,30.33 SJI2C.2
.VREF2-2  (via drill 0.3)
  Top 0.254: 7.96,32.97 10.44,35.45 10.44,37.53 IC4.7 10.6,37.69 10.6,38.17 11.4,38.97 11.4,46.81 16.52,46.81 17.8,48.09 UART.2 | 7.64,32.65 7.96,32.97 | 7.64,32.65 6.76,31.77 C8.2 | R20.2 6.76,37.37 7.88,36.25 7.88,33.05 7.96,32.97 | v8.36,31.77 7.72,32.41 7.72,32.57 7.64,32.65
  Bottom 0.254: v8.36,31.77 11.08,31.77 11.08,30.49 SJUART.2
ADC6  (via drill 0.3)
  Top 0.254: v24.25,15.8 24.25,15.6 25.25,15.6 IC3.19 | v17.65,22 17.25,22.4 17.25,23.2 R9.2 | v13.65,22.8 13.65,23.2 12.45,23.2 R1.1
  Bottom 0.254: v24.25,15.8 21.25,18.8 21.25,22 v17.65,22 14.45,22 v13.65,22.8
ADC6_IN
  Top 0.254: R1.2 10.45,23.4 6.85,23.4 ADC.1
ADC7
  Top 0.254: IC3.22 25.45,18 26.05,18 26.45,18.4 26.45,21.4 26.25,21.6 26.25,23.2 R17.1 26.45,23.4 28.85,23.4 R18.2
ADC7_IN  (via drill 0.3)
  Top 0.254: v19.05,23.4 24.25,23.4 R17.2
  Bottom 0.254: v19.05,23.4 9.45,23.4 7.65,21.6 5.85,21.6 4.25,23.2 ADC.2
GND  (via drill 0.51)
  Top 0.305: v23.13,15.84 23.13,16.48 24.09,16.48 24.57,16.96 24.57,17.12 25.37,17.12 IC3.21 | v21.53,13.76 v21.53,15.84 | 17.89,17.76 16.89,17.76 IC3.3 16.73,17.76 15.93,17.76 15.81,17.7
  Bottom 0.305: v21.53,15.84 v23.13,15.84 | v21.53,13.76 21.37,13.6 21.37,13.12 21.85,12.64 23.13,12.64 23.77,13.28 24.25,13.28 24.73,13.76 31.13,13.76 v31.45,13.44
  pour Bottom: 0.08,25.2 0.25,0 48.41,0 48.39,25.12
  pour Top: 0.13,24.92 0.25,0 48.41,-0.15 48.29,24.92
MISO  (via drill 0.3)
  Top 0.254: v25.45,12.8 25.45,12.6 24.05,12.6 IC3.16 | v27.45,12.8 29.45,10.8 29.45,9 30.65,7.8 34.25,7.8 34.25,7.2 v38.25,3.2
  Bottom 0.254: v25.45,12.8 v27.45,12.8 | v38.25,3.2 39.85,1.6 41.85,1.6 ICSP.1
MOSI  (via drill 0.3)
  Top 0.254: v23.25,9.8 23.25,12.4 IC3.15 | v25.25,8.2 26.25,7.2 26.25,5.8 26.85,5.2 27.85,5.2 29.05,4 29.05,3.6 29.85,2.8 37.65,2.8 37.85,2.6 41.45,2.6 41.65,2.8 43.65,2.8 43.65,3.2 44.45,4 ICSP.4
  Bottom 0.254: v23.25,9.8 24.85,8.2 v25.25,8.2
N$1  (via drill 0.3)
  Top 0.254: GPIO.1 6.85,5.2 6.85,2.2 10.05,2.2 L2.A 10.25,2 10.25,1.8 11.25,1.8 v11.45,2 | v15.25,2 16.45,2 R2.2
  Bottom 0.254: v11.45,2 v15.25,2
N$2  (via drill 0.3)
  Top 0.254: v8.85,4.4 10.05,4.4 L3.A 10.25,4.6 10.85,4.6 12.45,6.2 14.65,6.2 16.45,4.4 R3.2
  Bottom 0.254: v8.85,4.4 8.05,3.6 5.65,3.6 4.05,5.2 GPIO.2
N$3
  Top 0.254: R13.1 17.8,37.69 20.2,37.69 IC5.8
N$4
  Top 0.254: R4.2 2.6,47.45 4.36,47.45 4.84,46.97 7.56,46.97 7.56,48.09 SPI.4
N$6
  Top 0.254: Q2.1 18.95,9.09 16.53,11.51 16.53,11.81 C2.2 16.16,12.18 16.16,12.85 16.09,12.92 16.09,13.43 16.56,13.9 IC3.8
N$7
  Top 0.254: IC3.7 15.6,14.7 14.91,14.01 12.92,14.01 11.78,12.86 11.78,11.61 10.88,10.72 10.65,10.72 C3.2
  Top 0.305: C3.2 10.5,10.32 12.7,8.13 14.09,8.13 Q2.2
N$8  (via drill 0.3)
  Top 0.254: v14.12,44.41 15.4,45.69 R10.1
  Bottom 0.254: v14.12,44.41 13,45.53 10.28,45.53 SPI.5
N$9
  Top 0.254: R11.1 5.16,42.49 7.56,44.89 7.56,45.53 SPI.3
N$10
  Top 0.254: R12.2 2.6,42.49 5.16,45.05 5.16,45.53 SPI.1
N$12  (via drill 0.3)
  Top 0.254: v6.76,34.49 6.76,35.61 R20.1 | v8.52,36.25 9.16,36.89 9.16,37.53 IC4.8
  Bottom 0.254: v6.76,34.49 v8.52,36.25
N$18  (via drill 0.3)
  Top 0.254: v44.7,40.13 45.29,39.55 v45.29,37.72
  Bottom 0.254: v44.7,40.13 45.44,40.13 HMC5883L.12 | v45.29,37.72 45.29,36.45 C12.2
N$19
  Bottom 0.254: HMC5883L.8 46.13,37.95 46.13,37.41 46.15,37.41 C12.1
N$20  (via drill 0.3)
  Top 0.254: v46.69,39.09 46.81,39.22 46.81,40.59 46.76,40.64 v46.76,43.2
  Bottom 0.254: v46.69,39.09 45.49,39.09 HMC5883L.10 | v46.76,43.2 45.95,42.82 45.95,42.37 C11.2
P_GND  (via drill 0.3)
  Top 0.254: v44.7,38.33 44.7,35.56 IC1.1 44.76,35.33 44.42,35 44.42,30.76 IO1.1
  Bottom 0.254: IO2.1 46.3,44.93 47.7,43.59 47.73,42.88 47.93,42.37 C11.1 48.01,42.27 49.28,41 49.28,35.05 48.26,34.31 C9.2 46.51,32.54 46.51,29.72 IO1.1 | 45.06,38.63 45.44,38.63 HMC5883L.9 | 45.06,38.63 44.88,38.84 44.88,39.55 44.98,39.6 45.44,39.6 HMC5883L.11 | v44.7,38.33 44.96,38.58 45.06,38.63
P_SCL1  (via drill 0.3)
  Top 0.254: v47.45,40.01 47.37,39.93 IC1.3 47.3,35.33 47.27,34.54 | IO1.3 46.91,30.76 46.91,34.19 47.27,34.54 | 47.27,34.54 47.3,34.57
  Bottom 0.254: v47.45,40.01 47.5,40.11 48.26,40.11 HMC5883L.1
P_SCL2
  Top 0.254: IC1.6 47.4,42.67 47.4,42.98 47.98,43.56 47.98,44.93 IO2.3
P_SDA1  (via drill 0.3)
  Top 0.254: v48.69,36.91 48.64,36.85 IC1.4 48.56,35.33 48.56,32.82 IO1.4
  Bottom 0.254: v48.69,36.91 48.84,36.91 48.84,40.39 48.67,40.56 47.83,40.56 47.62,40.77 HMC5883L.16
P_SDA2
  Top 0.254: IC1.5 49.05,42.19 49.05,46.43 IO2.4
P_VREF1  (via drill 0.3)
  Top 0.254: IO1.2 46.1,32.74 IC1.2 46.1,39.6 v46.23,39.73
  Bottom 0.254: 47.68,39.42 47.68,38.86 47.83,38.63 48.26,38.63 HMC5883L.4 | 47.68,39.42 47.7,39.42 47.88,39.6 48.26,39.6 HMC5883L.2 | 46.13,39.73 46.13,39.67 46.94,39.67 47.19,39.42 47.68,39.42 | 46.13,39.73 46.13,40.77 HMC5883L.13 | IO1.2 45.39,32.26 C9.1 | v46.23,39.73 46.13,39.73
P_VREF2
  Top 0.254: IC1.7 IC1.8 44.76,41.88 44.4,42.24 44.4,46.43 45.44,47.47 IO2.2
PB0  (via drill 0.3)
  Top 0.254: IC3.12 20.85,12.4 20.85,11.2 22.85,9.2 24.85,9.2 24.85,9.6 R8.2 25.05,9.8 25.05,10.6 v25.45,11 | v30.65,11.2 30.65,9.8 IC2.1
  Bottom 0.254: v30.65,11.2 30.45,11 v25.45,11
PB1  (via drill 0.3)
  Top 0.254: v22.65,10.6 21.65,11.6 21.65,12.4 IC3.13 | v37.45,11.8 37.45,15 37.05,15.4 37.05,15.8 IC2.11
  Bottom 0.254: v22.65,10.6 22.85,10.4 32.25,10.4 33.65,11.8 v37.45,11.8
PB2  (via drill 0.3)
  Top 0.254: v22.45,13.6 22.45,12.6 IC3.14 | v32.85,14.2 33.05,14.4 33.05,15.8 IC2.14
  Bottom 0.254: v22.45,13.6 23.05,14.2 v32.85,14.2
PC0  (via drill 0.3)
  Top 0.254: v23.85,17.2 23.85,18.8 25.25,18.8 IC3.23 | v29.05,14.8 32.25,11.6 33.05,11.6 | 33.05,11.6 33.05,9.8 IC2.3 | v38.05,13.4 39.45,13.4 40.65,14.6 40.65,16 41.85,17.2 IN1.1 | v33.85,13.4 33.05,12.6 33.05,11.6
  Bottom 0.254: v23.85,17.2 26.25,14.8 v29.05,14.8 | v33.85,13.4 v38.05,13.4
PC1  (via drill 0.3)
  Top 0.254: v25.85,20.4 25.85,20 25.45,19.6 IC3.24 | v29.45,17.8 29.25,17.6 v29.25,16.6 | v36.85,14.2 36.85,9.8 IC2.6
  Bottom 0.254: v25.85,20.4 28.45,17.8 v29.45,17.8 | v29.25,16.6 31.05,14.8 36.85,14.8 | 36.85,14.8 41.65,14.8 41.85,14.6 IN2.1 | v36.85,14.2 36.85,14.8
PC2  (via drill 0.3)
  Top 0.254: v24.05,19.6 24.05,20.8 IC3.25 | v37.85,17.4 38.05,17.2 38.05,16 IC2.10 38.25,15.8 v38.25,14.2
  Bottom 0.254: v24.05,19.6 25.25,18.4 27.25,18.4 28.45,17.2 37.65,17.2 v37.85,17.4 | v38.25,14.2 40.25,12.2 41.45,12.2 41.85,11.8 IN3.1
PC3  (via drill 0.3)
  Top 0.254: v23.25,19.8 23.25,20.8 IC3.26 | v32.45,19.4 34.45,17.4 34.45,16 IC2.13 34.45,15.8 34.45,13.4 v35.05,12.8
  Bottom 0.254: v23.25,19.8 24.45,21 27.85,21 29.45,19.4 v32.45,19.4 | v35.05,12.8 38.05,12.8 41.85,9 IN4.1
PD2  (via drill 0.3)
  Top 0.254: v15.45,18.2 15.45,20.8 18.25,20.8 IC3.32
  Bottom 0.254: v15.45,18.2 9.25,12 6.85,12 IN5.1
PD3  (via drill 0.3)
  Top 0.254: v19.13,18.08 17.85,19.36 16.89,19.36 IC3.1
  Bottom 0.254: v19.13,18.08 17.53,16.48 14.97,16.48 7.61,9.12 6.81,9.12 IN6.1
PD4  (via drill 0.3)
  Top 0.254: 16.89,18.56 IC3.2 16.89,18.66 17.66,18.66 18.91,17.42 v18.91,14.04 | 19.3,1.92 R2.1 19.82,1.92 v20.87,2.97
  Bottom 0.254: v20.87,2.97 20.87,8.49 19.43,9.93 18.6,9.93 17.26,11.27 17.26,12.9 18.39,14.03 18.89,14.03 v18.91,14.04
PD5  (via drill 0.3)
  Top 0.254: v18.45,11.2 18.45,12.4 IC3.9 | v33.85,12.4 35.05,11.2 35.05,10.6 35.45,10.2 35.45,9.8 IC2.5
  Bottom 0.254: v18.45,11.2 18.45,12.2 30.05,12.2 30.25,12.4 v33.85,12.4
PD6  (via drill 0.3)
  Top 0.254: v19.25,11.2 19.25,12.4 IC3.10 | v31.65,11.2 31.85,11 31.85,9.8 IC2.2
  Bottom 0.254: v19.25,11.2 19.65,11.6 30.05,11.6 30.25,11.8 31.05,11.8 v31.65,11.2
PD7
  Top 0.254: IC3.11 20.05,12.4 20.05,10 21.05,9 21.05,6.8 19.45,5.2 19.45,4.4 R3.1
PWM_
  Top 0.254: R22.2 25.48,45.69 25.48,43.13 PI.12
RESET  (via drill 0.3)
  Top 0.254: v20.65,19.8 20.65,20.8 IC3.29 20.85,21 20.85,22.2 v21.45,22.8 | v14.65,20 14.05,20.6 13.25,20.6 R5.1 | v36.65,8.2 36.25,8.6 36.25,17 35.45,17.8 34.65,17.8 33.05,19.4 v33.05,22
  Bottom 0.254: v20.65,19.8 20.45,20 v14.65,20 | v36.65,8.2 37.65,7.2 46.05,7.2 46.05,2.8 47.05,1.8 ICSP.5 | v33.05,22 32.25,22.8 v21.45,22.8
RXD  (via drill 0.3)
  Top 0.254: v19.85,19.4 19.85,20.8 IC3.30
  Bottom 0.254: v19.85,19.4 19.25,18.8 10.85,18.8 7.85,15.8 6.85,15.8 RXD.1
SCK  (via drill 0.3)
  Top 0.254: v35.45,5 35.45,5.2 29.65,5.2 29.05,5.8 29.05,7.01 28.19,7.87 27.38,7.87 26.65,8.6 26.65,12.6 25.45,13.8 IC3.17
  Bottom 0.254: v35.45,5 40.65,5 40.85,5.2 42.45,5.2 43.45,4.2 43.45,2.4 43.85,2.4 44.45,1.8 ICSP.3
SCL  (via drill 0.3)
  Top 0.254: v22.05,22.2 21.65,21.8 21.65,21 IC3.28 | v26.85,22 27.65,21.2 28.05,21.2 R7.2
  Bottom 0.254: v22.05,22.2 22.25,22 v26.85,22 27.45,22 29.05,20.4 35.45,20.4 35.65,20.2 37.45,20.2 38.65,19 SCL.1
SDA  (via drill 0.3)
  Top 0.254: v22.45,19.6 22.45,20.8 IC3.27 | v26.85,17.8 28.05,17.8 28.05,18.2 | 28.05,18.2 28.05,18.4 R6.2 28.05,18.2 | v29.45,18.8 28.85,18.2 28.05,18.2
  Bottom 0.254: v22.45,19.6 24.25,17.8 v26.85,17.8 | v29.45,18.8 35.85,18.8 SDA.1
TXD  (via drill 0.3)
  Top 0.254: v18.65,19.4 19.05,19.8 19.05,20.8 IC3.31
  Bottom 0.254: v18.65,19.4 8.65,19.4 7.85,18.6 6.85,18.6 TXD.1
VCC  (via drill 0.3)
  Top 0.254: IC3.6 16.65,15.4 | C1.1 13.85,15.4 | IC3.4 16.65,17 15.85,17 15.05,16.2 14.6,15.75 14.29,15.75 C1.1 | C1.1 13.65,15.4 10.45,15.4 C4.1 10.25,15.4 8.25,15.4 8.25,20.6 | IN6.2 4.25,9.2 4.25,11.8 IN5.2 4.25,12 4.25,15.6 RXD.2 4.25,15.8 4.25,18.4 TXD.2 4.25,18.6 4.25,20.6 8.25,20.6 | 8.25,20.6 10.25,20.6 R5.2 | SDA.2 36.05,21.4 38.65,21.4 SCL.2 | 26.45,15.4 26.45,15.8 26.05,16.2 25.45,16.2 IC3.20 | 26.45,15.4 26.45,14.8 25.45,14.8 IC3.18 25.25,14.6 24.65,14.6 v24.25,15 | 26.45,15.4 30.45,15.4 30.45,15.8 IC2.16 30.65,16 30.65,18.2 30.85,18.4 R6.1 31.05,18.6 31.05,21 R7.1 31.05,21.2 31.05,21.4 v32.25,21.4 | OUT1.2 24.65,4.2 27.25,4.2 OUT2.2 | OUT3.2 30.25,4.2 32.85,4.2 OUT4.2 | IN1.2 44.65,17.2 44.65,14.6 IN2.2 44.65,14.4 44.65,11.8 IN3.2 44.65,11.6 44.65,9 IN4.2 44.45,8.8 44.45,6.6 42.05,4.2 ICSP.2 | IC3.6 14.04,15.5 C1.1 | IC3.6 v18.17,15.5 v18.18,15.51
  Bottom 0.254: v32.25,21.4 35.85,21.4 SDA.2 | OUT2.2 27.45,4.2 30.05,4.2 OUT3.2 | OUT4.2 33.05,4.2 41.85,4.2 ICSP.2 | SCL.2 38.85,21.4 41.45,18.8 43.25,18.8 44.65,17.4 IN1.2 | v18.18,15.51 18.18,15.45 18.64,15 v24.25,15

### Text on the board
bNames: 3.3V | 5V | 3.3V | 5V | 2013-01-13 | 2013-01-13
Changes: Bitte nur... | Raster: 0.0254 | Raster: 0.254 | Raster: 0.254 *10 | Beschriftungslayer: tNames, bNames